# Altium project A2Crev2.PrjPcb
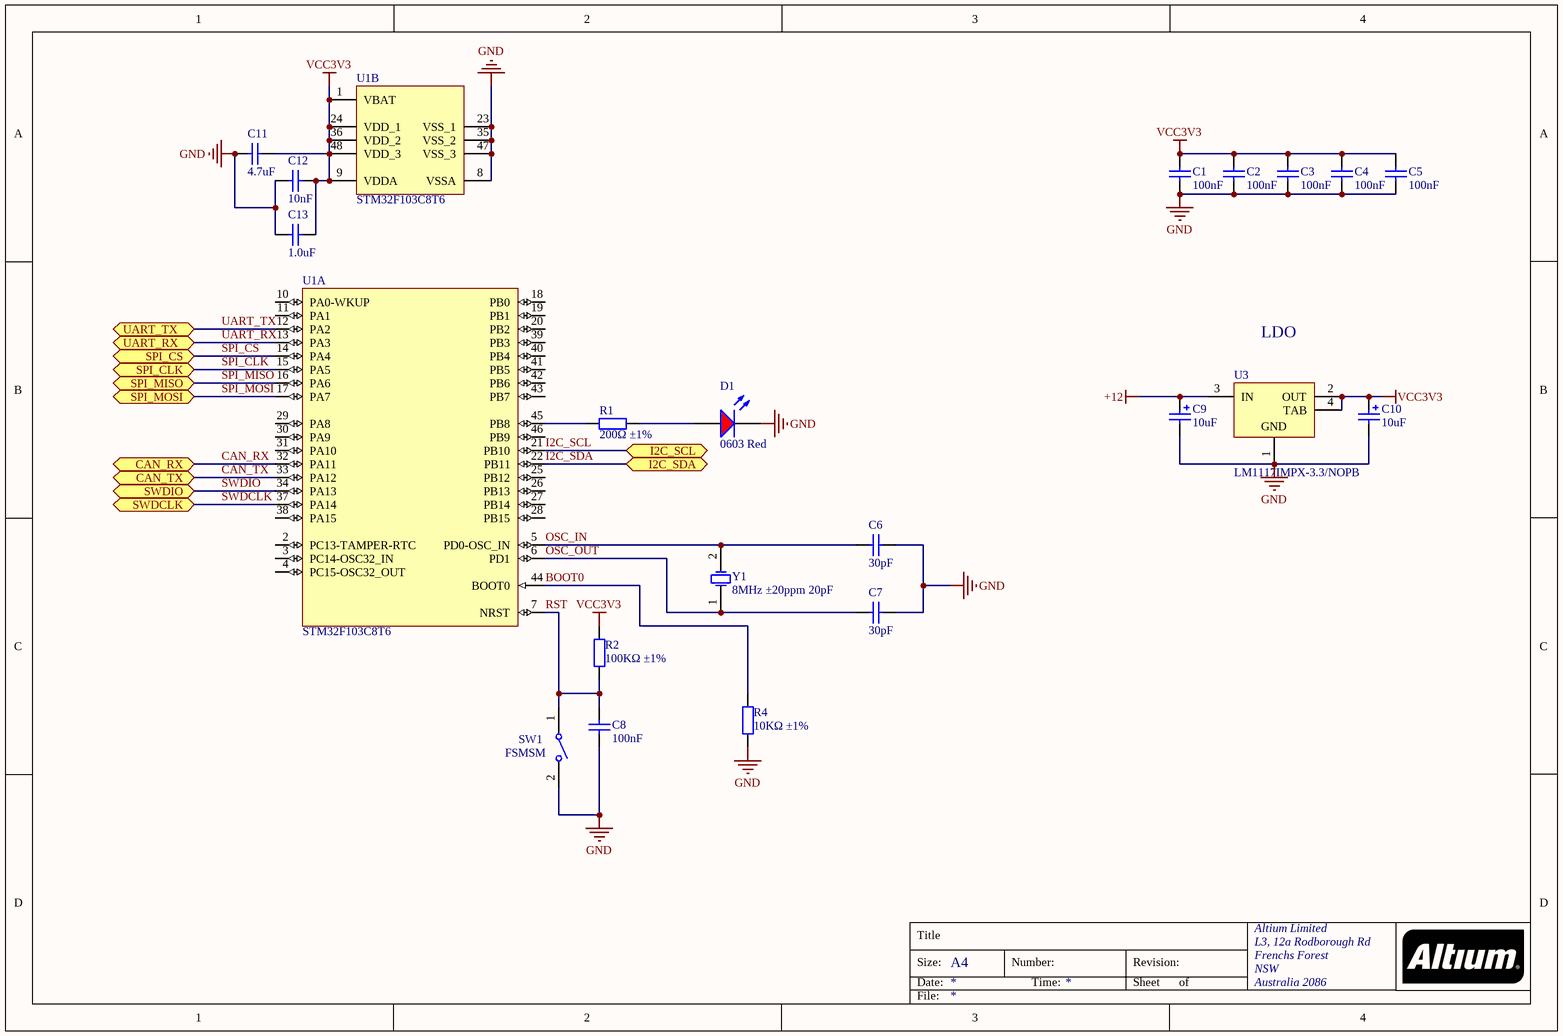
[diagram p0: MCU.SchDoc]
2 sheets, 29 parts. Net scope: flat (ports and power ports of the same name join across sheets).
Board file: PCB.PcbDoc
Sheets:
  MCU.SchDoc
  Connectors.SchDoc

## Sheet MCU.SchDoc
size A4; Organization: Altium Limited; Address1: L3, 12a Rodborough Rd; Address2: Frenchs Forest; Address3: NSW; Address4: Australia 2086

### Parts
C1  100nF  [0402_C]
C2  100nF  [0402_C]
C3  100nF  [0402_C]
C4  100nF  [0402_C]
C5  100nF  [0402_C]
C6  30pF  [0402_C]
C7  30pF  [0402_C]
C8  100nF  [0402_C]
C9  10uF  [CASE-A_3216]
C10  10uF  [CASE-A_3216]
C11  4.7uF  [0402_C]
C12  10nF  [0402_C]
C13  1.0uF  [0402_C]
D1  0603 Red  [0603_LED_S1]
R1  200Ω ±1%  [0402_R]
R2  100KΩ ±1%  [0402_R]
R4  10KΩ ±1%  [0402_R]
SW1  FSMSM  [TECO-FSMSM-2_V]
U1  STM32F103C8T6  [LQFP-48_7x7x05P]  (parts A,B of 2)
U3  LM1117IMPX-3.3/NOPB  [MP04A_M]
Y1  8MHz ±20ppm 20pF  [SMD-5032_2P]

### Ports
CAN_RX (bidir), CAN_TX (bidir), I2C_SCL (bidir), I2C_SDA (bidir), SPI_CLK (bidir), SPI_CS (bidir), SPI_MISO (bidir), SPI_MOSI (bidir), SWDCLK (bidir), SWDIO (bidir), UART_RX (bidir), UART_TX (bidir)

### Nets
+12: C9.1 U3.3(IN)
GND: C1.1 C2.1 C3.1 C4.1 C5.1 C6.2 C7.2 C8.1 C9.2 C10.2 C11.1 C12.1 C13.1 D1.K R4.1 SW1.2 U1.8(VSSA) U1.23(VSS_1) U1.35(VSS_2) U1.47(VSS_3) U3.1(GND)
VCC3V3: C1.2 C2.2 C3.2 C4.2 C5.2 C10.1 C11.2 C12.2 C13.2 R2.2 U1.1(VBAT) U1.9(VDDA) U1.24(VDD_1) U1.36(VDD_2) U1.48(VDD_3) U3.2(OUT) U3.4(TAB)
BOOT0: R4.2 U1.44(BOOT0)
CAN_RX: U1.32(PA11) ; port CAN_RX
CAN_TX: U1.33(PA12) ; port CAN_TX
I2C_SCL: U1.21(PB10) ; port I2C_SCL
I2C_SDA: U1.22(PB11) ; port I2C_SDA
OSC_IN: C6.1 U1.5(PD0-OSC_IN) Y1.2(OSC2)
OSC_OUT: C7.1 U1.6(PD1) Y1.1(OSC1)
RST: C8.2 R2.1 SW1.1 U1.7(NRST)
SPI_CLK: U1.15(PA5) ; port SPI_CLK
SPI_CS: U1.14(PA4) ; port SPI_CS
SPI_MISO: U1.16(PA6) ; port SPI_MISO
SPI_MOSI: U1.17(PA7) ; port SPI_MOSI
SWDCLK: U1.37(PA14) ; port SWDCLK
SWDIO: U1.34(PA13) ; port SWDIO
UART_RX: U1.13(PA3) ; port UART_RX
UART_TX: U1.12(PA2) ; port UART_TX
NetD1_A: D1.A R1.2
NetR1_1: R1.1 U1.45(PB8)

Not connected (* = marked no-connect by the designer): U1 2(PC13-TAMPER-RTC) 3(PC14-OSC32_IN) 4(PC15-OSC32_OUT) 10(PA0-WKUP) 11(PA1) 18(PB0) 19(PB1) 20(PB2) 25(PB12) 26(PB13) 27(PB14) 28(PB15) 29(PA8) 30(PA9) 31(PA10) 38(PA15) 39(PB3) 40(PB4) 41(PB5) 42(PB6) 43(PB7) 46(PB9)

### Notes on the sheet
- LDO
- Title
- Size:
- Date:
- A4
- Number:
- Time:
- Revision:
- Sheet
- of
- File:

### Library data of the parts
C1-C5 C8 = 0402 100nF (104) 10% 16V: Chip capacitors; Manufacturer: Samsung Electro-Mechanics; PartNumber: CL05B104KO5NNNC; Tolerance: 10%; Voltage: 16V; ComponentLink1Description: Supplier link; ComponentLink1URL: http://www.szlcsc.com/product/details_1877.html; Package: 0402; Supplier: LC; SuppliersPartNumber: C1525; Capacitance: 100nF
C6 C7 = 0402 30pF (300) 5% 50V: Chip capacitors; Manufacturer: Guangdong Fenghua Advanced Tech; PartNumber: 0402CG300J500NT; Tolerance: 5%; Voltage: 50V; ComponentLink1Description: Supplier link; ComponentLink1URL: http://www.szlcsc.com/product/details_1922.html; Package: 0402; Supplier: LC; SuppliersPartNumber: C1570; Capacitance: 30pF
C9 C10 = 3216 10uF (106) 10% 16V: Tantalum capacitor; Manufacturer: AVX; PartNumber: TAJA106K016RNJ; Tolerance: 10%; Voltage: 16V; ComponentLink1Description: Supplier link; ComponentLink1URL: http://www.szlcsc.com/product/details_7643.html; Package: 3216; Supplier: LC; SuppliersPartNumber: C7171; Capacitance: 10uF
C11 = 0402 4.7uF (475) 20% 10V: Chip capacitor; Manufacturer: Samsung Electro-Mechanics; PartNumber: CL05A475MP5NRNC; Tolerance: 20%; Voltage: 10V; ComponentLink1Description: Supplier link; ComponentLink1URL: http://www.szlcsc.com/product/details_24469.html; Package: 0402; Supplier: LC; SuppliersPartNumber: C23733; Capacitance: 4.7uF
C12 = 0402 10nF (103) 10% 50V: Chip capacitors; Manufacturer: Samsung Electro-Mechanics; PartNumber: CL05B103KB5NNNC; Tolerance: 10%; Voltage: 50V; ComponentLink1Description: Supplier link; ComponentLink1URL: http://www.szlcsc.com/product/details_15869.html; Package: 0402; Supplier: LC; SuppliersPartNumber: C15195; Capacitance: 10nF
C13 = 0402 1.0uF (105) 10% 25V: Chip capacitor; Manufacturer: Samsung Electro-Mechanics; PartNumber: CL05A105KA5NQNC; Capacitance: 1uF; Tolerance: 10%; Voltage: 25V; ComponentLink1Description: Supplier link; ComponentLink1URL: http://www.szlcsc.com/product/details_53938.html; Package: 0402; Supplier: LC; SuppliersPartNumber: C52923
D1 = 0603 LED Red: LED; ComponentLink1Description: 供应商链接; ComponentLink1URL: http://www.szlcsc.com/product/details_2659.html; Package: 0603; Supplier: LC; SuppliersPartNumber: C2286; Color: Red
R1 = 0402 200R (2000) 1%: Chip resistor; Manufacturer: Uniroyal Elec; PartNumber: 0402WGF2000TCE; Power: 1/16W; ComponentLink1Description: Supplier link; ComponentLink1URL: http://www.szlcsc.com/product/details_25830.html; Package: 0402; Supplier: LC; SuppliersPartNumber: C25087; Resistance: 200Ω; Tolerance: 1%
R2 = 0402 100K (1003) 1%: Chip resistor; Manufacturer: Uniroyal Elec; PartNumber: 0402WGF1003TCE; Power: 1/16W; ComponentLink1Description: Supplier link; ComponentLink1URL: http://www.szlcsc.com/product/details_26484.html; Package: 0402; Supplier: LC; SuppliersPartNumber: C25741; Resistance: 100KΩ; Tolerance: 1%
R4 = 0402 10K (1002) 1%: Chip resistor; Manufacturer: Uniroyal Elec; PartNumber: 0402WGF1002TCE; Power: 1/16W; ComponentLink1Description: Supplier link; ComponentLink1URL: http://www.szlcsc.com/product/details_26487.html; Package: 0402; Supplier: LC; SuppliersPartNumber: C25744; Resistance: 10KΩ; Tolerance: 1%
SW1 = CMP-2000-07511-1: FSMSM Push Button Switch, 50 mA, -35 to 85 degC, 2-Pin SMD, RoHS, Bulk; Manufacturer: TE Connectivity; Actuator Length: 1.07mm; Electrical Life: 20000Cycles; Actuator Material: Polyamide; Current Rating: 50mA; Illumination Type: Illuminated; Voltage Rating (DC): 24V; Contact Resistance: 100mOhm; Case\/Package: SMD/SMT; Operating Force: 180gf; Switch Travel: 0.25mm; Max Voltage Rating (DC): 12V; Throw Configuration: SPST; Packaging: LoosePiece; Max Operating Temperature: 85degC; ELV: Compliant; Package Description: 2-Pin Surface Mount Device, Body 6 x 3.5 mm, Pitch 9.19 mm; RoHSCompliant: true; Manufacturer URL: http://www.te.com/; Contact Plating: Silver; Contact Material: Brass; Mounting Technology: SurfaceMount; Contact Current Rating: 50mA; Datasheet Version: Rev. C2, 08/2014; Datasheet URL: http://www.te.com/commerce/DocumentDelivery/DDEController?Action=showdoc&DocId=Customer+Drawing%7F1437566-3%7FC2%7Fpdf%7FEnglish%7FENG_CD_1437566-3_C2_1437566_3_1_c.dwg.pdf%7F1437566-3; Mechanical Life: 20000Cycles; Package Reference: FSMSM; REACH SVHC: Unknown; Orientation: Straight; Min Operating Temperature: -35degC; Lead Free: LeadFree; Termination: GullWing; Package Quantity: 1000; Mount: SurfaceMount
U1 = STM32F103C8T6: ARM; ComponentLink1Description: 供应商链接; ComponentLink1URL: http://www.szlcsc.com/product/details_9243.html; Package: LQFP-48_7x7x05P; Supplier: LC; SuppliersPartNumber: C8734
U3 = CMP-0062-01632-3: 800mA Low-Dropout Linear Regulator, 4-pin SOT-223, Pb-Free; Manufacturer: National Semiconductor; CompType: LDO IC; PackageTopMarking: XYTT*N05B; High-Reliability: Y; PowerWise: N; ComponentLink3Description: LM1117 Web Page; Code_JEDEC: TO-261-AA; RoHS: Y; PackageReference: MP04A; ComponentLink3URL: http://www.national.com/pf/LM/LM1117.html; RevisionNote: SCH symbol layout adjusted; ComponentLink2URL: http://www.national.com/ds/LM/LM1117.pdf; ComponentLink2Description: LM1117 Datasheet; ComponentLink1Description: Manufacturer URL; ComponentLink4Description: MP04A Package Page; ComponentLink4URL: http://www.national.com/packaging/folders/mp04a.html; PackageVersion: revB, Apr-2003; DatasheetVersion: Apr-2006; PackageDescription: Molded SOT-223, 6.50 x 3.56 x 1.6mm Body, 4 Lead, 2.3mm Pitch; Code_IPC: SOT223-4; ComponentLink1URL: http://www.national.com/; PinCount: 4; PartNumber: LM1117IMPX-3.3/NOPB
Y1 = SMD-5032_2P 8MHz 20ppm 20pF: 贴片晶振; ComponentLink1Description: 供应商链接; ComponentLink1URL: http://www.szlcsc.com/product/details_117214.html; Package: SMD-5032_2P; Supplier: LC; SuppliersPartNumber: C115962

## Sheet Connectors.SchDoc
size A4
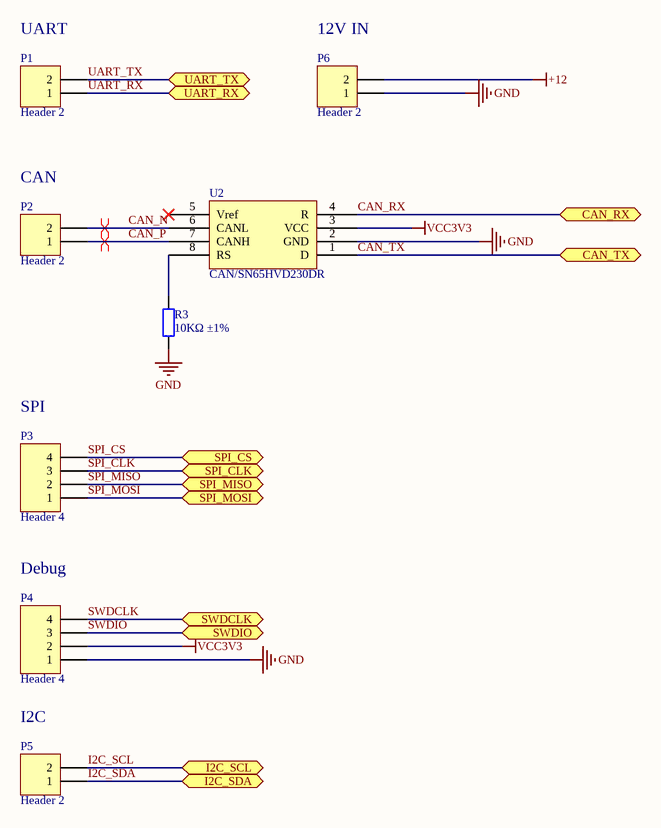
[diagram p1: Connectors.SchDoc]

### Parts
P1  Header 2  [HDR1X2]
P2  Header 2  [HDR1X2]
P3  Header 4  [HDR1X4]
P4  Header 4  [HDR1X4]
P5  Header 2  [HDR1X2]
P6  Header 2  [HDR1X2]
R3  10KΩ ±1%  [0402_R]
U2  CAN/SN65HVD230DR  [SOIC-8_150mil]

### Ports
CAN_RX (bidir), CAN_TX (bidir), I2C_SCL (bidir), I2C_SDA (bidir), SPI_CLK (bidir), SPI_CS (bidir), SPI_MISO (bidir), SPI_MOSI (bidir), SWDCLK (bidir), SWDIO (bidir), UART_RX (bidir), UART_TX (bidir)

### Nets
+12: P6.2
GND: P4.1 P6.1 R3.1 U2.2(GND)
VCC3V3: P4.2 U2.3(VCC)
CAN_N: P2.2 U2.6(CANL)
CAN_P: P2.1 U2.7(CANH)
CAN_RX: U2.4(R) ; port CAN_RX
CAN_TX: U2.1(D) ; port CAN_TX
I2C_SCL: P5.2 ; port I2C_SCL
I2C_SDA: P5.1 ; port I2C_SDA
SPI_CLK: P3.3 ; port SPI_CLK
SPI_CS: P3.4 ; port SPI_CS
SPI_MISO: P3.2 ; port SPI_MISO
SPI_MOSI: P3.1 ; port SPI_MOSI
SWDCLK: P4.4 ; port SWDCLK
SWDIO: P4.3 ; port SWDIO
UART_RX: P1.1 ; port UART_RX
UART_TX: P1.2 ; port UART_TX
NetR3_2: R3.2 U2.8(RS)

Not connected (* = marked no-connect by the designer): U2 5(Vref)*

### Layout directives
differential pair: CAN_N, CAN_P

### Notes on the sheet
- (near P1) UART
- (near P6) 12V IN
- (near P2) CAN
- (near P3) SPI
- Debug
- I2C

### Library data of the parts
P1 P2 P5 P6 = Header 2: Header, 2-Pin; LatestRevisionDate: 17-Jul-2002; LatestRevisionNote: Re-released for DXP Platform.; Publisher: Altium Limited
P3 P4 = Header 4: Header, 4-Pin; LatestRevisionDate: 17-Jul-2002; LatestRevisionNote: Re-released for DXP Platform.; Publisher: Altium Limited
R3 = 0402 10K (1002) 1%: as R4 on sheet MCU; ComponentLink1Description: Supplier link; ComponentLink1URL: http://www.szlcsc.com/product/details_26487.html; Package: 0402; Supplier: LC; SuppliersPartNumber: C25744; Resistance: 10KΩ; Tolerance: 1%
U2 = CAN/SN65HVD230DR_[C12084]: CAN; ComponentLink1Description: 供应商链接; ComponentLink1URL: http://www.szlcsc.com/product/details_12661.html; Package: SOIC-8_150mil; Supplier: LC; SuppliersPartNumber: C12084

## Nets that join several sheets
+12: MCU (C9.1 U3.3), Connectors (P6.2)
GND: MCU (21 pins), Connectors (P4.1 P6.1 R3.1 U2.2)
VCC3V3: MCU (17 pins), Connectors (P4.2 U2.3)
CAN_RX: MCU (U1.32), Connectors (U2.4)
CAN_TX: MCU (U1.33), Connectors (U2.1)
I2C_SCL: MCU (U1.21), Connectors (P5.2)
I2C_SDA: MCU (U1.22), Connectors (P5.1)
SPI_CLK: MCU (U1.15), Connectors (P3.3)
SPI_CS: MCU (U1.14), Connectors (P3.4)
SPI_MISO: MCU (U1.16), Connectors (P3.2)
SPI_MOSI: MCU (U1.17), Connectors (P3.1)
SWDCLK: MCU (U1.37), Connectors (P4.4)
SWDIO: MCU (U1.34), Connectors (P4.3)
UART_RX: MCU (U1.13), Connectors (P1.1)
UART_TX: MCU (U1.12), Connectors (P1.2)